# EAGLE design board (EAGLE 6.1)
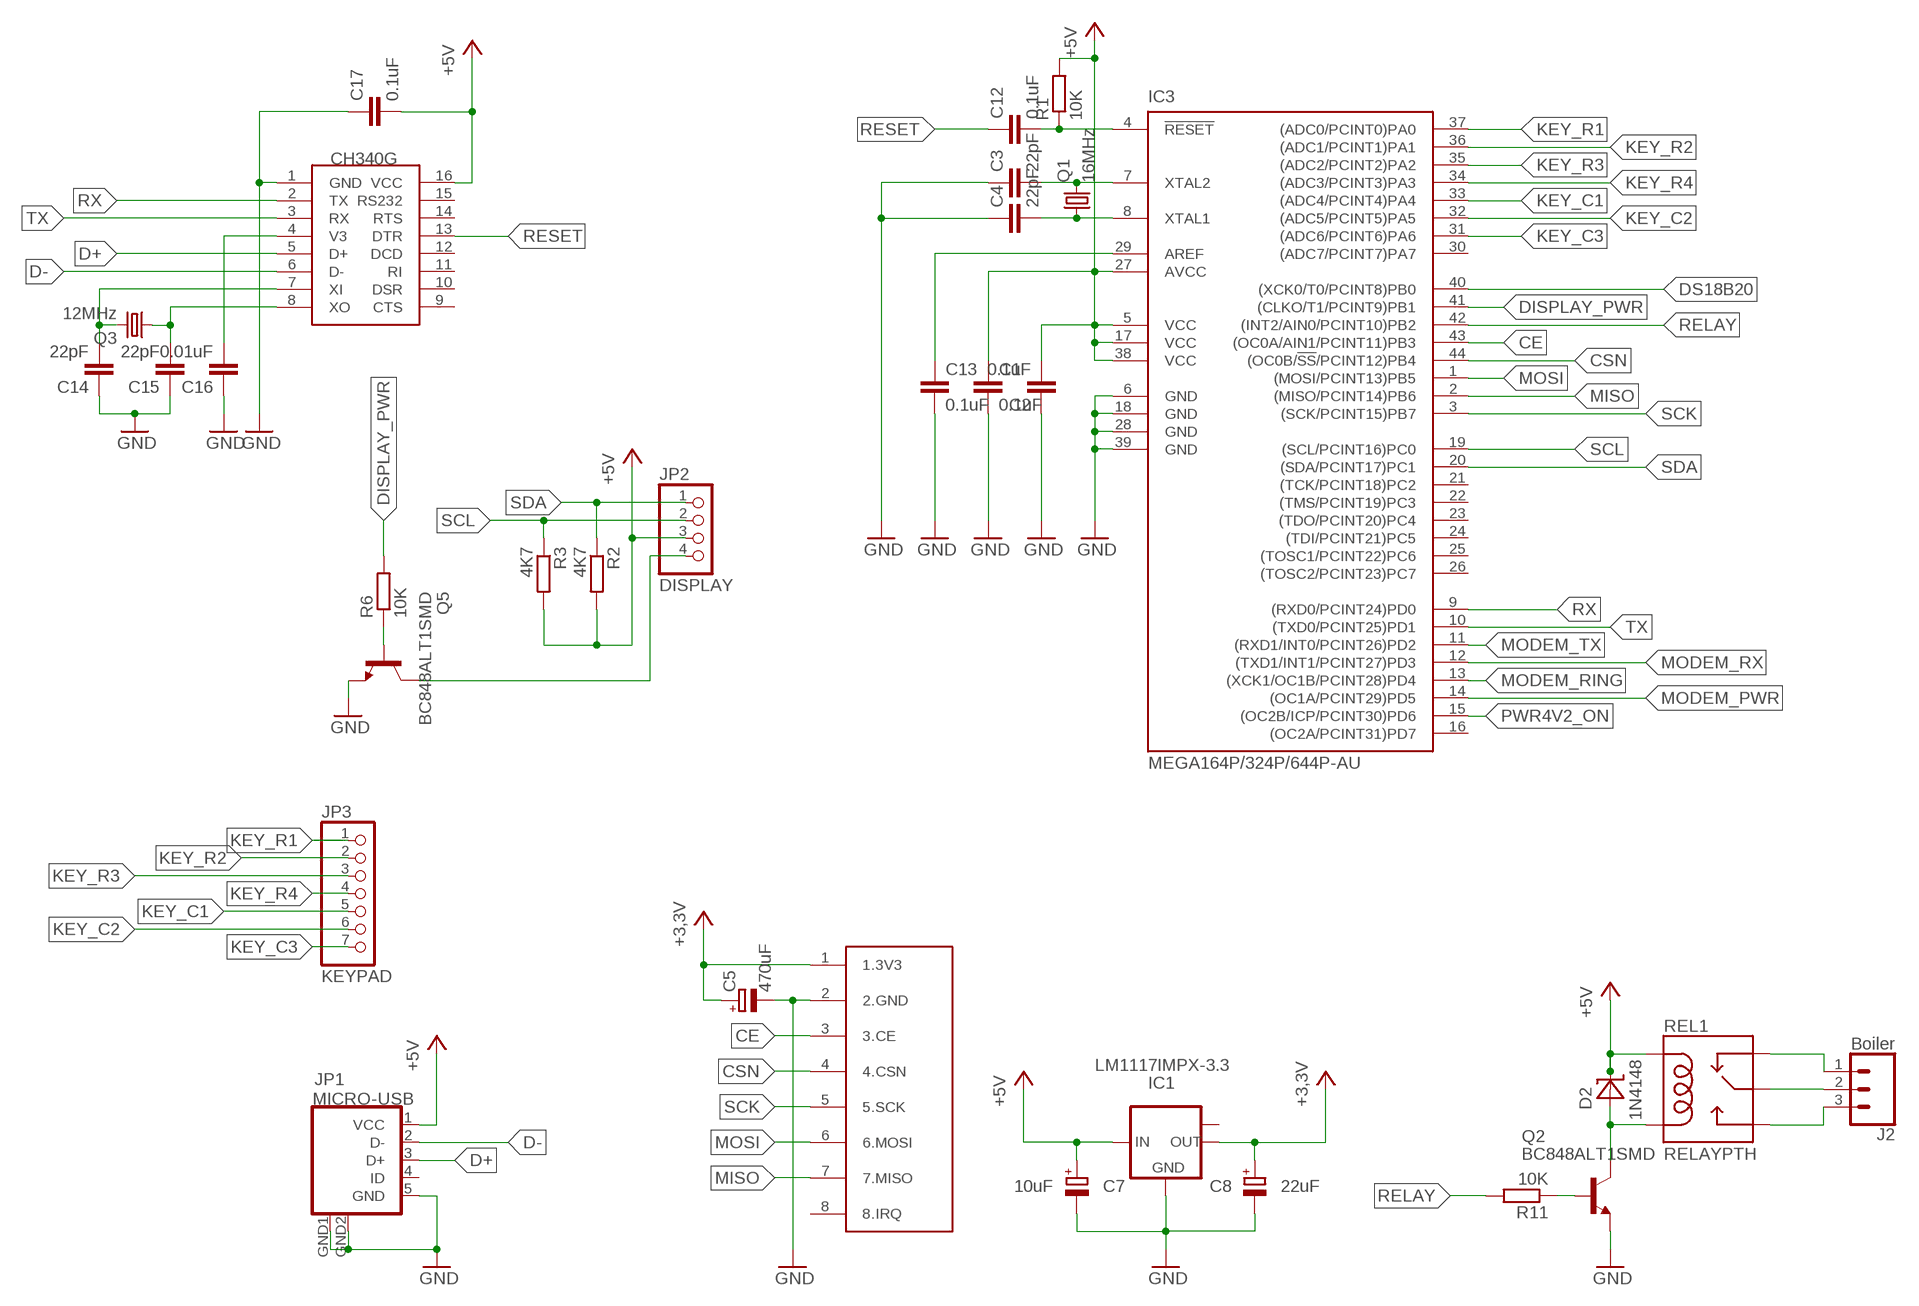
[diagram p0: schematic, sheet 1, part 1 of 2]
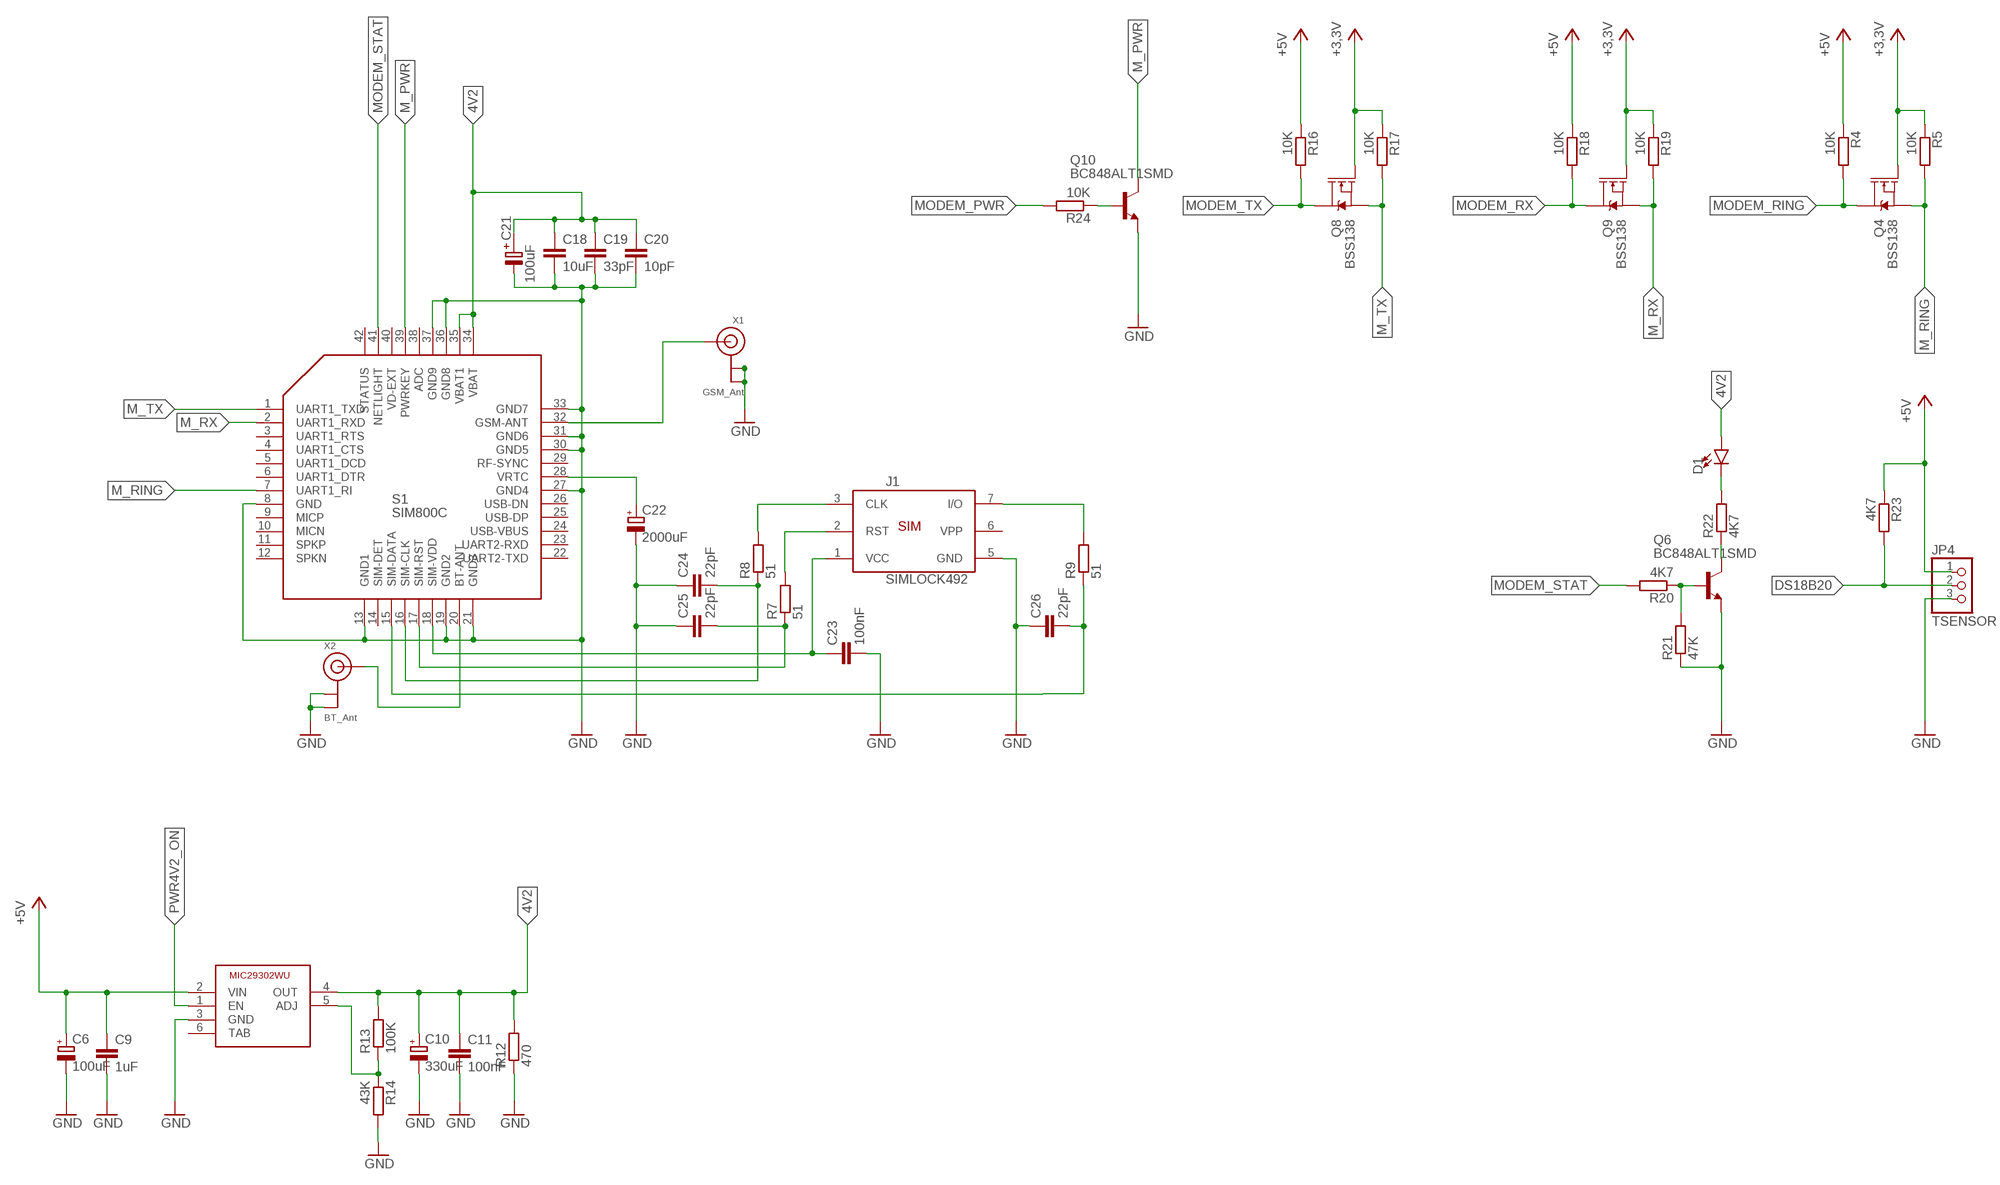
[diagram p1: schematic, sheet 1, part 2 of 2]

## Parts
C1  0.1uF  C-EUC1206  [C1206]
C2  0.1uF  C-EUC1206  [C1206]
C3  22pF  C-EUC1206  [C1206]
C4  22pF  C-EUC1206  [C1206]
C5  470uF  CPOL-EUE3.5-8  [E3,5-8]
C6  100uF  CPOL-EUE1.8-4  [E1,8-4]
C7  10uF  CPOL-EUE1.8-4  [E1,8-4]
C8  22uF  CPOL-EUE1.8-4  [E1,8-4]
C9  1uF  C-EUC1206  [C1206]
C10  330uF  CPOL-EUE1.8-4  [E1,8-4]
C11  100nF  C-EUC1206  [C1206]
C12  0.1uF  C-EUC1206  [C1206]
C13  0.1uF  C-EUC1206  [C1206]
C14  22pF  C-EUC1206  [C1206]
C15  22pF  C-EUC1206  [C1206]
C16  0.01uF  C-EUC1206  [C1206]
C17  0.1uF  C-EUC1206  [C1206]
C18  10uF  C-EUC1206  [C1206]
C19  33pF  C-EUC1206  [C1206]
C20  10pF  C-EUC1206  [C1206]
C21  100uF  C-PR-SMD-TE-D  [TE-D-7343]
C22  2000uF  CPOL-EUE3.5-8  [E3,5-8]
C23  100nF  C-EUC1206  [C1206]
C24  22pF  C-EUC1206  [C1206]
C25  22pF  C-EUC1206  [C1206]
C26  22pF  C-EUC1206  [C1206]
D1  LED1206  [LED-1206]
D2  1N4148  1206ZENERSOD323  [SOD323-W]
IC1  LM1117IMPX-3.3  [SOT223]
IC2  MIC29302WU  [TO263-5]
IC3  MEGA164P/324P/644P-AU  [TQFP44]
J1  SIMLOCK492  [5002]
J2  Boiler  CONN_03-SCREW-5MM  [SCREWTERMINAL-5MM-3]
JP1  MICRO-USB  [MICRO-USB]
JP2  DISPLAY  PINHD-1X4  [1X04]
JP3  KEYPAD  PINHD-1X7  [1X07]
JP4  TSENSOR  PINHD-1X3  [1X03]
Q1  16MHz  CRYTALHC49S  [HC49/S]
Q2  BC848ALT1SMD  [SOT23]
Q3  12MHz  CRYTALHC49S  [HC49/S]
Q4  BSS138  MOSFET-NCH-BSS138  [SOT23-3]
Q5  BC848ALT1SMD  [SOT23]
Q6  BC848ALT1SMD  [SOT23]
Q8  BSS138  MOSFET-NCH-BSS138  [SOT23-3]
Q9  BSS138  MOSFET-NCH-BSS138  [SOT23-3]
Q10  BC848ALT1SMD  [SOT23]
R1  10K  R-EU_R1206  [R1206]
R2  4K7  R-EU_R1206  [R1206]
R3  4K7  R-EU_R1206  [R1206]
R4  10K  R-EU_R1206  [R1206]
R5  10K  R-EU_R1206  [R1206]
R6  10K  R-EU_R1206  [R1206]
R7  51  R-EU_R1206  [R1206]
R8  51  R-EU_R1206  [R1206]
R9  51  R-EU_R1206  [R1206]
R11  10K  R-EU_R1206  [R1206]
R12  470  R-EU_R1206  [R1206]
R13  100K  R-EU_R1206  [R1206]
R14  43K  R-EU_R1206  [R1206]
R16  10K  R-EU_R1206  [R1206]
R17  10K  R-EU_R1206  [R1206]
R18  10K  R-EU_R1206  [R1206]
R19  10K  R-EU_R1206  [R1206]
R20  4K7  R-EU_R1206  [R1206]
R21  47K  R-EU_R1206  [R1206]
R22  4K7  R-EU_R1206  [R1206]
R23  4K7  R-EU_R1206  [R1206]
R24  10K  R-EU_R1206  [R1206]
REL1  RELAYPTH  [SRD-05VDC-SL-C]
S1  SIM800C  [SIM800C]
U$1  CH340G  [SOIC16]
U$3  NRF24L01+  [NRF24L01+]
X1  GSM_Ant  ANTENNA_U.FL  [U.FL]
X2  BT_Ant  ANTENNA_U.FL  [U.FL]

## Nets
4V2: C10.+ C11.1 C18.1 C19.1 C20.1 C21.+ D1.A IC2.4(OUT) R12.2 R13.2 S1.34(VBAT) S1.35(VBAT1)
+3,3V: C5.+ C8.+ IC1.2(OUT) Q4.1(G) Q8.1(G) Q9.1(G) R5.1 R17.1 R19.1 U$3.1(1.3V3)
+5V: C1.1 C2.2 C6.+ C7.+ C9.1 C17.2 D2.C IC1.3(IN) IC2.2(VIN) IC3.5(VCC) IC3.17(VCC) IC3.27(AVCC) IC3.38(VCC) JP1.1(VCC) JP2.3 JP4.1 R1.2 R2.2 R3.2 R4.1 R16.1 R18.1 R23.1 REL1.COIL1 U$1.16(VCC)
CE: IC3.43((OC0A/AIN1/PCINT11)PB3) U$3.3(3.CE)
CSN: IC3.44((OC0B/!SS!/PCINT12)PB4) U$3.4(4.CSN)
D+: JP1.3(D+) U$1.5(D+)
D-: JP1.2(D-) U$1.6(D-)
DISPLAY_PWR: IC3.41((CLKO/T1/PCINT9)PB1) R6.2
DS18B20: IC3.40((XCK0/T0/PCINT8)PB0) JP4.2 R23.2
GND: C1.2 C2.1 C3.1 C4.1 C5.- C6.- C7.- C8.- C9.2 C10.- C11.2 C13.2 C14.1 C15.1 C16.1 C17.1 C18.2 C19.2 C20.2 C21.- C22.- C23.2 C24.1 C25.1 C26.1 IC1.1(GND) IC2.3(GND) IC3.6(GND) IC3.18(GND) IC3.28(GND) IC3.39(GND) J1.5(GND) JP1.5(GND) JP1.GND1(GND) JP1.GND2(GND) JP4.3 Q2.2(E) Q5.2(E) Q6.2(E) Q10.2(E) R12.1 R14.2 R21.1 S1.8(GND) S1.13(GND1) S1.19(GND2) S1.21(GND3) S1.27(GND4) S1.30(GND5) S1.31(GND6) S1.33(GND7) S1.36(GND8) S1.37(GND9) U$1.1(GND) U$3.2(2.GND) X1.1(GND) X1.2(GND) X2.1(GND) X2.2(GND)
KEY_C1: IC3.33((ADC4/PCINT4)PA4) JP3.5
KEY_C2: IC3.32((ADC5/PCINT5)PA5) JP3.6
KEY_C3: IC3.31((ADC6/PCINT6)PA6) JP3.7
KEY_R1: IC3.37((ADC0/PCINT0)PA0) JP3.1
KEY_R2: IC3.36((ADC1/PCINT1)PA1) JP3.2
KEY_R3: IC3.35((ADC2/PCINT2)PA2) JP3.3
KEY_R4: IC3.34((ADC3/PCINT3)PA3) JP3.4
M_PWR: Q10.3(C) S1.39(PWRKEY)
M_RING: Q4.2(S) R5.2 S1.7(UART1_RI)
M_RX: Q9.2(S) R19.2 S1.2(UART1_RXD)
M_TX: Q8.2(S) R17.2 S1.1(UART1_TXD)
MISO: IC3.2((MISO/PCINT14)PB6) U$3.7(7.MISO)
MODEM_PWR: IC3.14((OC1A/PCINT29)PD5) R24.2
MODEM_RING: IC3.13((XCK1/OC1B/PCINT28)PD4) Q4.3(D) R4.2
MODEM_RX: IC3.12((TXD1/INT1/PCINT27)PD3) Q9.3(D) R18.2
MODEM_STAT: R20.2 S1.41(NETLIGHT)
MODEM_TX: IC3.11((RXD1/INT0/PCINT26)PD2) Q8.3(D) R16.2
MOSI: IC3.1((MOSI/PCINT13)PB5) U$3.6(6.MOSI)
N$1: C3.2 IC3.7(XTAL2) Q1.2
N$2: C4.2 IC3.8(XTAL1) Q1.1
N$3: C13.1 IC3.29(AREF)
N$4: C12.2 IC3.4(!RESET) R1.1
N$5: C14.2 Q3.2 U$1.7(XI)
N$6: C15.2 Q3.1 U$1.8(XO)
N$7: JP2.4 Q5.3(C)
N$8: Q5.1(B) R6.1
N$9: C16.2 U$1.4(V3)
N$10: C22.+ S1.28(VRTC)
N$11: C23.1 J1.1(VCC) S1.18(SIM-VDD)
N$12: D2.A Q2.3(C) REL1.COIL0
N$13: Q2.1(B) R11.1
N$14: J2.1 REL1.SWCLOSED(SWCLOSE)
N$15: J2.2 REL1.SWCOMMON
N$16: J2.3 REL1.SWOPEN
N$17: C25.2 R7.1 S1.17(SIM-RST)
N$18: J1.2(RST) R7.2
N$19: IC2.5(ADJ) R13.1 R14.1
N$20: C24.2 R8.1 S1.16(SIM-CLK)
N$21: J1.3(CLK) R8.2
N$22: C26.2 R9.1 S1.15(SIM-DATA)
N$23: J1.7(I/O) R9.2
N$24: S1.32(GSM-ANT) X1.3(SIGNAL)
N$25: Q6.1(B) R20.1 R21.2
N$26: Q6.3(C) R22.1
N$27: D1.C R22.2
N$28: S1.20(BT-ANT) X2.3(SIGNAL)
N$29: Q10.1(B) R24.1
PWR4V2_ON: IC2.1(EN) IC3.15((OC2B/ICP/PCINT30)PD6)
RELAY: IC3.42((INT2/AIN0/PCINT10)PB2) R11.2
RESET: C12.1 U$1.13(DTR)
RX: IC3.9((RXD0/PCINT24)PD0) U$1.2(TX)
SCK: IC3.3((SCK/PCINT15)PB7) U$3.5(5.SCK)
SCL: IC3.19((SCL/PCINT16)PC0) JP2.2 R3.1
SDA: IC3.20((SDA/PCINT17)PC1) JP2.1 R2.1
TX: IC3.10((TXD0/PCINT25)PD1) U$1.3(RX)
Unconnected: IC1.TAB(OUT1) IC2.6(TAB) IC3.16((OC2A/PCINT31)PD7) IC3.21((TCK/PCINT18)PC2) IC3.22((TMS/PCINT19)PC3) IC3.23((TDO/PCINT20)PC4) IC3.24((TDI/PCINT21)PC5) IC3.25((TOSC1/PCINT22)PC6) IC3.26((TOSC2/PCINT23)PC7) IC3.30((ADC7/PCINT7)PA7) J1.6(VPP) JP1.4(ID) S1.3(UART1_RTS) S1.4(UART1_CTS) S1.5(UART1_DCD) S1.6(UART1_DTR) S1.9(MICP) S1.10(MICN) S1.11(SPKP) S1.12(SPKN) S1.14(SIM-DET) S1.22(UART2-TXD) S1.23(UART2-RXD) S1.24(USB-VBUS) S1.25(USB-DP) S1.26(USB-DN) S1.29(RF-SYNC) S1.38(ADC) S1.40(VD-EXT) S1.42(STATUS) U$1.9(CTS) U$1.10(DSR) U$1.11(RI) U$1.12(DCD) U$1.14(RTS) U$1.15(RS232) U$3.8(8.IRQ)

## Library data of the parts
C1-C4 C9 C11-C20 C23-C26 = resistor:C-EU: CAPACITOR, European symbol
C5-C8 C10 C22 = resistor:CPOL-EU: POLARIZED CAPACITOR, European symbol
C21 = cap-pan40:C-PR: POLARIZED ELECTROLYTIC/TANTALUM
D1 = SparkFun-LED:LED: LED (Generic) Standard schematic elements and footprints for 5mm, 3mm, 1206, and 0603 sized LEDs. Generic LEDs with no color specified.
D2 = matt diode:1206ZENER
IC1 = lm1117:LM1117IMPX-*
IC2 = MIC29302WU:MIC29302WU; AVAILABILITY: Good; DESCRIPTION: IC REG LINEAR POS ADJ 3A TO263-5; MF: Microchip; MP: MIC29302WU; PACKAGE: TO-263-5 Microchip; PRICE: 1.41 USD
IC3 = avr-5:MEGA164P/324P/644P-AU
J1 = amphenol-simlock:SIMLOCK492
J2 = SparkFun-Connectors:CONN_03: Multi connection point. Often used as Generic Header-pin footprint for 0.1 inch spaced/style header connections On any of the 0.1 inch spaced packages, you can populate with these: Break Away Headers - Straight <https://www.sparkfun.com/products/116> (PRT-00116) Break Away Male Headers - Right Angle <https://www.sparkfun.com/products/553> (PRT-00553) Female Headers <https://www.sparkfun.com/products/115> (PRT-00115) Break Away Headers - Machine Pin <https://www.sparkfun.com/products/117> (PRT-00117) Break Away Female Headers - Swiss Machine Pin <https://www.sparkfun.com/products/743> (PRT-00743) Stackable Header - 3 Pin (Female, 0.1") <https://www.sparkfun.com/products/13875> (PRT-13875) For SCREWTERMINALS and SPRING TERMINALS visit here: Screw Terimnals on SparkFun.com <https://www.sparkfun.com/search/results?term=Screw+Terminals> (5mm/3.5mm/2.54mm spacing) This device is also useful as a general connection point to wire up your design to another part of your project. Our various solder wires solder well into these plated through hole pads. Hook-Up Wire - Assortment (Stranded, 22 AWG) <https://www.sparkfun.com/products/11375> (PRT-11375) Hook-Up Wire - Assortment (Solid Core, 22 AWG) <https://www.sparkfun.com/products/11367> (PRT-11367) View the entire wire category on our website here <https://www.sparkfun.com/categories/141> Special notes: Molex polarized connector foot print use with SKU : PRT-08232 with associated crimp pins and housings.; PROD_ID: CONN-10134; SF_SKU: PRT-08433
JP1 = microusb:MICRO-USB: Micro USB B connector
JP2 = pinhead:PINHD-1X4: PIN HEADER
JP3 = pinhead:PINHD-1X7: PIN HEADER
JP4 = pinhead:PINHD-1X3: PIN HEADER
Q1 Q3 = crystal:CRYTAL: CRYSTAL
Q2 Q5 Q6 Q10 = transistor-npn:BC848*: NPN Transistor
Q4 Q8 Q9 = SparkFun-DiscreteSemi:MOSFET-NCH: N-channel MOSFETs Voltage controlled devices that allow control of high current outputs. SparkFun Products: SparkFun OpenScale <https://www.sparkfun.com/products/13261> SparkFun Digital Sandbox <https://www.sparkfun.com/products/12651> SparkFun Monster Moto Shield <https://www.sparkfun.com/products/10182> SparkFun MOSFET Power Controller <https://www.sparkfun.com/products/11214>; PROD_ID: TRANS-00830; VALUE: 220mA/50V/3.5Ω
R1-R9 R11-R14 R16-R24 = resistor:R-EU_: RESISTOR, European symbol
REL1 = SRD-05VDC-SL-C:RELAY: SPDT relay (COM-00101)
S1 = Sim800c:SIM800C: SIM800c quad band GSM moude
U$1 = ch340g:CH340G
U$3 = NRF24l01+:NRF24L01+
X1 X2 = adafruit1:ANTENNA_U.FL: U.FL Antenna Connector

## Board
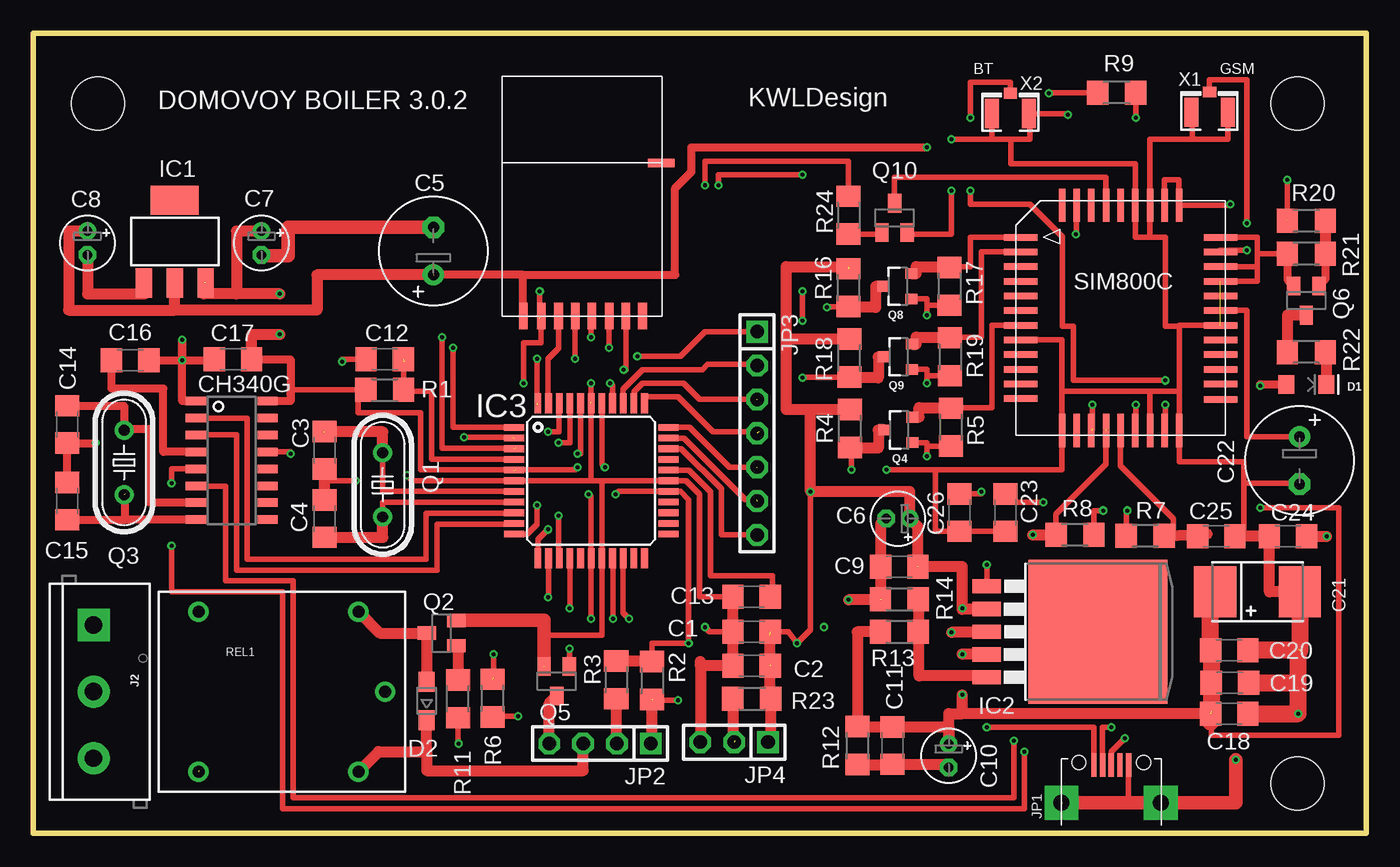
[diagram p2: board, top side]
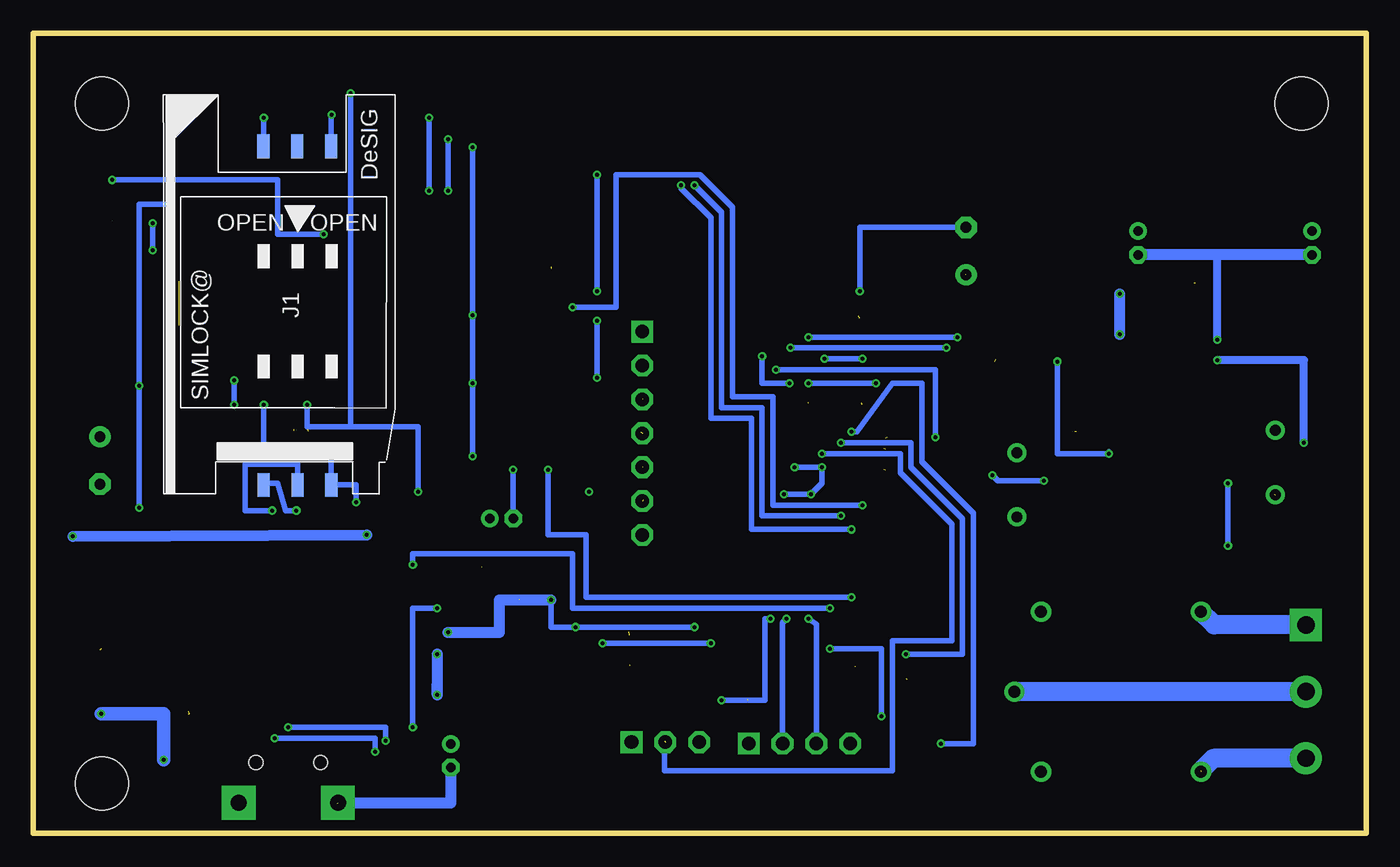
[diagram p3: board, bottom side, seen from below]

Size 100 x 60 mm. Coordinates in mm from the lower left corner, seen from the top.
Outline: 0,0 100,0
Outline: 100,0 100,60
Outline: 100,60 0,60
Outline: 0,60 0,0
Outline: 0,60 100,60
Outline: 100,60 100,0
Outline: 100,0 0,0
Outline: 0,0 0,60
Copper layers (1*16): Top 0.035mm / dielectric 1.5mm / Bottom 0.035mm
Design rules: minimum track width 8mil, minimum drill 0.3mm, track to track 8mil, track to pad 8mil, pad to pad 8mil, via to via 8mil, smd to smd 8mil, copper to edge 40mil, drill to drill 8mil, minimum pad ring 12mil, minimum via ring 6mil, stop-mask expansion 4mil, vias tented up to drill 0mil, thermal gap 10mil
Holes 4 mm at 4.84,54.74 94.84,54.74 94.84,3.74

### Footprints (pad centres in the part's own frame; a part is rotated, then mirrored left to right if it is on the bottom)
C1206 = smd 1.6 x 1.8: 1 -1.4,0; 2 1.4,0
E3,5-8 = drill 0.813 pad 1.6: + -1.778,0 | drill 0.813 pad 1.6 octagon: - 1.778,0
E1,8-4 = drill 0.711 pad 1.168: + -0.889,0 | drill 0.711 pad 1.168 octagon: - 0.889,0
TE-D-7343 = smd 3.175 x 3.81: + 3.175,0; - -3.175,0
LED-1206 = smd 1.2 x 1.4: A -1.5,0; C 1.5,0
SOD323-W = smd 1.5 x 1.2: A 1.45,0; C -1.45,0
SOT223 = smd 1.219 x 2.235: 1 -2.311,-3.099; 2 0,-3.099; 3 2.311,-3.099 | smd 3.6 x 2.2: TAB 0,3.099
TO263-5 = smd 1.067 x 2.159: 1 -3.404,-5.791; 2 -1.702,-5.791; 3 0,-5.791; 4 1.702,-5.791; 5 3.404,-5.791 | smd 10.8 x 10.41: 6 0,2.54
TQFP44 = smd 1.5 x 0.5: 1 -5.8,4; 2 -5.8,3.2; 3 -5.8,2.4; 4 -5.8,1.6; 5 -5.8,0.8; 6 -5.8,0; 7 -5.8,-0.8; 8 -5.8,-1.6; 9 -5.8,-2.4; 10 -5.8,-3.2; 11 -5.8,-4; 23 5.8,-4; 24 5.8,-3.2; 25 5.8,-2.4; 26 5.8,-1.6; 27 5.8,-0.8; 28 5.8,0; 29 5.8,0.8; 30 5.8,1.6; 31 5.8,2.4; 32 5.8,3.2; 33 5.8,4 | smd 0.5 x 1.5: 12 -4,-5.8; 13 -3.2,-5.8; 14 -2.4,-5.8; 15 -1.6,-5.8; 16 -0.8,-5.8; 17 0,-5.8; 18 0.8,-5.8; 19 1.6,-5.8; 20 2.4,-5.8; 21 3.2,-5.8; 22 4,-5.8; 34 4,5.8; 35 3.2,5.8; 36 2.4,5.8; 37 1.6,5.8; 38 0.8,5.8; 39 0,5.8; 40 -0.8,5.8; 41 -1.6,5.8; 42 -2.4,5.8; 43 -3.2,5.8; 44 -4,5.8
5002 = smd 1.778 x 0.914: 1 0.65,0.32; 2 0.65,2.86; 3 0.65,5.4; 5 26.045,0.34; 6 26.045,2.88; 7 26.045,5.42
SCREWTERMINAL-5MM-3 = drill 1.3 pad 2.413 square: 1 0,0 | drill 1.3 pad 2.413: 2 5,0; 3 10,0
MICRO-USB = smd 0.4 x 1.75: 1 -1.3,4.525; 2 -0.65,4.525; 3 0,4.525; 4 0.65,4.525; 5 1.3,4.525 | drill 1.2 pad 2.54 square: GND1 -3.725,1.7; GND2 3.725,1.7 | hole 1.05: -2.425,4.73; 2.425,4.73
1X04 = drill 1.016 square: 1 -3.81,0 | drill 1.016 octagon: 2 -1.27,0; 3 1.27,0; 4 3.81,0
1X07 = drill 1.016 square: 1 -7.62,0 | drill 1.016 octagon: 2 -5.08,0; 3 -2.54,0; 4 0,0; 5 2.54,0; 6 5.08,0; 7 7.62,0
1X03 = drill 1.016 square: 1 -2.54,0 | drill 1.016 octagon: 2 0,0; 3 2.54,0
HC49/S = drill 0.813: 1 -2.413,0; 2 2.413,0
SOT23 = smd 1 x 1.4: 1 -0.95,-1.1; 2 0.95,-1.1; 3 0,1.1
SOT23-3 = smd 0.8 x 0.9: 1 -0.95,-1; 2 0.95,-1; 3 0,1.1
R1206 = smd 1.6 x 1.803: 1 -1.422,0; 2 1.422,0
SRD-05VDC-SL-C = drill 0.9: COIL0 -5.39,-6.12; COIL1 -5.39,5.88; SWCLOSED 6.61,-6.12; SWCOMMON -7.39,-0.12; SWOPEN 6.61,5.88
SIM800C = smd 2.5 x 0.48: 1 -6.85,2.05; 2 -6.85,0.95; 3 -6.85,-0.15; 4 -6.85,-1.25; 5 -6.85,-2.35; 6 -6.85,-3.45; 7 -6.85,-4.55; 8 -6.85,-5.65; 9 -6.85,-6.75; 10 -6.85,-7.85; 11 -6.85,-8.95; 12 -6.85,-10.05; 22 8.15,-10.1; 23 8.15,-8.95; 24 8.15,-7.85; 25 8.15,-6.75; 26 8.15,-5.65; 27 8.15,-4.55; 28 8.15,-3.45; 29 8.15,-2.35; 30 8.15,-1.25; 31 8.15,-0.15; 32 8.15,0.95; 33 8.15,2.05 | smd 0.48 x 2.5: 13 -3.75,-12.45; 14 -2.65,-12.45; 15 -1.55,-12.45; 16 -0.45,-12.45; 17 0.65,-12.45; 18 1.75,-12.45; 19 2.85,-12.45; 20 3.95,-12.45; 21 5.05,-12.45; 34 5.05,4.45; 35 3.95,4.45; 36 2.85,4.45; 37 1.75,4.45; 38 0.65,4.45; 39 -0.45,4.45; 40 -1.55,4.45; 41 -2.65,4.45; 42 -3.75,4.45
SOIC16 = smd 0.635 x 1.524: 1 -4.445,-2.695; 2 -3.175,-2.695; 3 -1.905,-2.695; 4 -0.635,-2.695; 5 0.635,-2.695; 6 1.905,-2.695; 7 3.175,-2.695; 8 4.445,-2.695; 9 4.445,2.695; 10 3.175,2.695; 11 1.905,2.695; 12 0.635,2.695; 13 -0.635,2.695; 14 -1.905,2.695; 15 -3.175,2.695; 16 -4.445,2.695
NRF24L01+ = smd 0.65 x 2: 1 1.6,0; 2 2.95,0; 3 4.25,0; 4 5.5,0; 5 6.75,0; 6 8.05,0; 7 9.3,0; 8 10.55,0 | smd 2 x 0.65: 9 11.96,11.49
U.FL = smd 2.2 x 1.05: 1 0,1.375; 2 0,-1.375 | smd 0.8 x 1: 3 1.525,0

### Placement (x,y rotation side)
C1  53.9,15.12 180 top
C2  53.9,12.58 0 top
C3  21.84,28.73 90 top
C4  21.84,23.6 270 top
C5  30.02,43.67 90 top
C6  64.87,23.6 180 top
C7  17.12,44.28 270 top
C8  4.06,44.28 270 top
C9  64.97,19.99 180 top
C10  68.68,5.82 270 top
C11  64.47,6.58 270 top
C12  26.37,35.54 0 top
C13  53.9,17.76 180 top
C14  2.54,30.66 90 top
C15  2.54,24.92 270 top
C16  7.26,35.49 180 top
C17  14.99,35.54 0 top
C18  89.71,8.97 0 top
C19  89.76,11.31 0 top
C20  89.71,13.75 0 top
C21  91.85,18.12 180 top
C22  95,27.97 270 top
C23  72.95,24.06 270 top
C24  94.13,22.28 0 top
C25  88.75,22.28 180 top
C26  69.49,24.06 90 top
D1  95.5,33.66 0 top
D2  29.51,9.94 90 top
IC1  10.62,44.38 0 top
IC2  77.32,15.12 270 top
IC3  41.86,26.45 0 top
J1  77.32,25.48 90 bottom
J2  4.52,15.63 270 top
JP1  80.87,0.59 0 top
JP2  42.52,6.74 180 top
JP3  54.31,30 270 top
JP4  52.58,6.84 180 top
Q1  26.21,26.14 90 top
Q2  30.63,15.02 90 top
Q3  6.81,27.82 90 top
Q4  64.97,30.26 90 top
Q5  39.27,11.41 180 top
Q6  95.5,39.96 180 top
Q8  64.87,41.03 90 top
Q9  64.92,35.74 90 top
Q10  64.62,46.16 0 top
R1  26.37,33.25 180 top
R2  46.43,11.46 90 top
R3  43.74,11.51 90 top
R4  61.26,30.36 270 top
R5  68.83,30.46 90 top
R6  34.44,10.14 90 top
R7  83.41,22.33 180 top
R8  78.15,22.38 0 top
R9  81.28,55.55 0 top
R11  31.85,10.09 270 top
R12  61.82,6.58 90 top
R13  64.97,15.12 180 top
R14  64.97,17.56 180 top
R16  61.16,40.92 270 top
R17  68.73,41.03 90 top
R18  61.21,35.64 270 top
R19  68.78,35.74 90 top
R20  95.5,45.95 180 top
R21  95.5,43.46 0 top
R22  95.5,36.1 0 top
R23  53.9,10.09 180 top
R24  61.16,46.36 90 top
REL1  19,10.5 180 top
S1  80.92,42.65 0 top
U$1  14.88,27.97 270 top
U$3  35.15,38.79 0 top
X1  88.24,54.08 90 top
X2  73.3,53.98 90 top

### Tracks (layer width: path | path; a pad name or v marks a point on that pad's centre or on a via)
4V2  (via drill 0.3)  (2 unrouted)
  Top 0.406: S1.35 84.87,49 85.95,49 85.95,47.1 S1.34 89.81,47.1 v89.81,47.17 | v92.05,24.41 97.94,24.41 97.94,14.66 97.94,7.35 93.27,7.35 88.39,7.35 88.39,8.97
  Top 0.61: D1.A 92.05,33.66 v92.05,33.56
  Top 0.813: IC2.4 71.53,13.44 v69.7,13.44 | 88.39,8.97 69.7,8.97 | 69.7,8.97 v69.7,10.39 | R13.2 61.82,15.12 R12.2 64.47,8.01 C11.1 68.68,7.98 C10.+ 68.68,8.97 69.7,8.97
  Top 1.27: C19.1 88.36,13.75 C20.1 88.31,18.12 C21.+ | C19.1 88.31,11.31 | C18.1 88.31,8.36 | C19.1 88.36,9.17 88.19,9.17
  Bottom 0.406: v89.81,47.17 92.05,47.17 92.05,33.76 | 92.05,33.76 v92.05,33.56 | v92.05,33.56 v92.05,24.41 | v92.05,33.56 92.05,33.76
  Bottom 0.813: v69.7,13.44 69.7,11.21 | 69.7,11.21 v69.7,10.39 69.7,11.21
+3,3V  (via drill 0.3)  (1 unrouted)
  Top 0.406: R17.1 67.06,39.6 v67.06,38.84 67.06,40.08 Q8.1 | R19.1 67.06,34.32 v67.06,33.76 67.06,34.79 Q9.1 | R5.1 67.06,29.04 67.06,28.89 | 67.06,28.89 v67.06,28.28 | Q4.1 67.06,29.31 67.06,28.89
  Top 0.61: 36.75,41.89 U$3.1 36.75,41.89 | 36.75,41.89 30.07,41.89 | 36.75,41.89 48.16,41.89 48.16,48.39 49.38,49.61 49.38,51.44 v67.06,51.44
  Top 0.813: C8.+ 2.64,45.17 2.64,39.25 10.36,39.25 | 10.36,39.25 10.57,39.25 10.62,39.25 IC1.2 | 10.36,39.25 21.29,39.25 21.29,41.89 C5.+
  Bottom 0.406: 67.06,44.12 67.06,43.92 | 67.06,43.92 v67.06,38.84 v67.06,33.76 v67.06,28.28 | v67.06,51.44 67.06,43.92
+5V  (via drill 0.3)  (6 unrouted)
  Top 0.406: R1.2 24.38,33.25 | 24.38,33.25 24.38,33.36 24.38,33.25 | 24.38,33.25 24.38,31.53 29.06,31.53 29.06,27.26 36.17,27.26 40.64,27.26 v40.84,27.46 | v42.88,27.46 42.66,27.68 IC3.38 | v41.66,25.43 41.86,25.23 IC3.17 v41.86,16.08 | v43.69,25.43 43.9,25.65 IC3.27 48.56,25.65 49.17,25.04 v49.17,14.25 46.43,14.25 R2.2 | 24.38,33.25 19.3,33.25 19.3,32.95 | JP1.1 79.57,7.95 v71.53,7.95 | C1.1 56.64,15.12 v57.3,14.25 58.32,15.27 v58.32,25.63
  Top 0.61: C17.2 19.3,35.54 19.3,32.95 19.3,32.54 19.3,32.42 U$1.16
  Top 0.813: IC2.2 71.53,16.79 69.7,16.79 v69.7,16.9 69.7,19.99 66.34,19.99 66.34,23.02 C6.+ 65.76,25.63 v58.32,25.63 58.32,31.78 | C7.+ 15.24,45.17 15.24,40.67 15.24,40.47 | 15.24,40.47 12.8,40.47 12.8,41.28 | REL1.COIL1 25.9,6.13 29.46,6.13 29.52,6.18 | 29.52,6.18 D2.C | C17.2 16.39,37.42 v18.49,37.42 | v18.49,40.47 15.24,40.47 | 29.52,6.18 29.52,4.7 41.25,4.7 JP2.3 | 61.16,42.5 56.49,42.5 56.49,37.06 | R18.1 56.49,37.06 | R4.1 58.32,31.78 | 58.32,31.78 56.49,31.78 56.49,37.06 | JP4.1 55.32,6.63 R23.1 55.27,10.09 55.27,12.63 | C2.2 55.27,12.58 55.27,14.86 | R3.2 46.43,12.93 R2.2
  Bottom 0.406: v42.88,27.46 v40.84,27.46 40.84,26.24 v41.66,25.43 v43.69,25.43 | v41.86,16.08 41.25,15.68 JP2.3 | v58.32,25.63 58.32,25.65 | v71.53,7.95 71.53,16.9 v69.7,16.9 | v49.17,14.25 v57.3,14.25
  Bottom 0.813: v18.49,37.42 v18.49,40.47
CE
  Top 0.406: U$3.3 39.4,36.39 38.61,35.59 38.61,32.3 IC3.43
CSN  (via drill 0.3)  (1 unrouted)
  Top 0.406: U$3.4 40.65,36.62 v40.64,35.59 | v37.8,35.59 37.8,32.14
  Bottom 0.406: v40.64,35.59 v37.8,35.59
D+  (via drill 0.3)
  Top 0.406: JP1.3 80.87,6.12 v81.89,7.14 | U$1.5 10.36,27.33 v10.36,26.24 | v10.36,21.57 10.36,18.12 18.69,18.12 18.69,1.86 23.37,1.86 74.37,1.86 v74.37,6.13
  Bottom 0.406: v81.89,7.14 75.59,7.14 74.37,7.14 v74.37,6.13 | v10.36,26.24 v10.36,21.57
D-  (via drill 0.3)
  Top 0.406: JP1.2 80.22,7.95 v80.87,7.95 | v73.56,6.94 73.56,2.67 19.51,2.67 19.51,18.93 14.43,18.93 14.43,26.04 12.19,26.04 U$1.6
  Bottom 0.406: v80.87,7.95 73.56,7.95 v73.56,6.94
DISPLAY_PWR  (via drill 0.3)  (1 unrouted)
  Top 0.406: IC3.41 40.26,29.29 v39.42,29.29 | v34.54,13.44 34.54,11.61
  Bottom 0.406: v39.42,29.29 39.22,29.29 34.14,29.29 34.14,27.46 30.28,23.6 30.28,13.44 v34.54,13.44
DS18B20  (via drill 0.3)  (1 unrouted)
  Top 0.406: IC3.40 41.06,28.48 v40.84,28.48
  Top 0.813: R23.2 52.48,6.84 JP4.2
  Bottom 0.406: v40.84,28.48 34.95,28.48 34.95,27.06 31.09,23.2 31.09,14.46 35.56,14.46 35.56,4.7 52.63,4.7 52.63,6.94
GND  (via drill 0.3)  (7 unrouted)
  Top 0.406: v24.18,26.45 21.84,26.45 21.84,26.65 | v28.04,26.85 28.45,26.45 IC3.6 41.66,26.45 | 41.66,26.45 41.86,26.45 41.86,32.34 v41.86,33.76 | 42.06,26.45 42.66,26.45 IC3.18 42.67,20.65 42.67,14.86 38.3,14.86 | 42.06,26.45 41.66,26.45 | 42.06,26.45 IC3.28 48.97,26.45 49.99,25.43 49.99,24.62 49.99,17.76 C13.2 | U$3.2 38.1,36.81 36.78,36.81 v36.78,33.76 | v38,40.67 38,38.64 | 67.67,27.26 77.17,27.26 S1.13 77.17,33.15 | 67.67,27.26 v64.01,27.26 | 83.77,44.7 S1.36 83.77,52.05 86.97,52.05 | 83.77,44.7 82.67,44.7 S1.37 82.67,50.22 73.36,50.22 73.36,52.05 | S1.8 77.17,37 77.17,33.15 | S1.19 83.77,33.15 | 83.77,33.15 77.17,33.15 | 85.97,33.15 S1.21 85.97,27.87 90.83,27.87 90.83,26.24 | 85.97,33.15 83.77,33.15 | S1.27 85.97,38.1 | 85.97,38.1 85.97,33.15 | 83.77,44.7 84.94,44.7 84.94,38.03 85.97,38.03 85.97,38.1 | C23.2 C26.1 67.67,22.66 67.67,27.26 | 90.83,26.24 90.83,22.38 C25.1 | C22.- 95,26.24 90.83,26.24 | S1.33 91.85,44.7 | 91.85,44.7 91.85,42.5 | 91.85,42.5 S1.31 | S1.30 91.85,41.4 91.85,42.5 | X1.2 89.61,52.05 86.97,52.05 | 86.97,52.05 86.97,53.88 X1.1 | X2.1 71.93,52.05 72.34,52.05 | 72.34,52.05 73.36,52.05 | 73.36,52.05 74.78,52.05 74.78,53.98 X2.2 77.62,53.98 v77.62,53.88 | 91.85,44.7 91.85,43.46 R21.1 | JP1.5 82.17,2.29 82.09,2.29 | C1.2 50.75,15.12 v50.39,15.47 | Q10.2 65.57,44.94 68.89,44.94 v68.89,48.19 | v68.89,52.05 72.34,52.05
  Top 0.61: C15.1 C14.1 4.67,29.26 v4.67,29.29 | C16.1 v11.18,35.49 | v11.18,35.49 13.59,35.49 C17.1 | U$1.1 11.18,32.42 v11.18,35.49 | v11.18,35.49 v11.18,37.01 | v11.18,37.01 v11.18,35.49 | v11.18,35.49 v11.18,37.01 | R21.1 94.08,41.53 Q6.2
  Top 0.813: C6.- 63.57,23.19 C9.2 63.57,17.3 | C8.- 4.06,40.47 8.33,40.47 8.33,41.28 IC1.1 | C4.1 21.84,26.65 C3.1 | 50.04,12.88 50.04,12.63 | 50.04,12.63 JP4.3 | C25.1 C24.1 92.73,18.12 C21.- | 50.04,12.63 50.04,12.58 C2.1 C1.2 C13.2 | 63.57,17.3 63.6,17.3 | R12.1 64.47,5.16 C11.2 68.68,5.18 C10.- | 63.57,17.3 63.57,17.51 v61.16,17.51 | IC2.3 71.53,15.07 v68.89,15.07
  Top 1.016: C5.- 19.1,45.45 19.1,43.31 17.12,43.31 C7.- | C18.2 v94.89,8.97 | v90.22,5.52 90.22,2.29 JP1.GND2 82.09,2.29 JP1.GND1 | Q2.2 38.3,15.97 38.3,14.86 38.3,12.53
  Top 1.27: C21.- 95.02,13.75 C20.2 | C19.2 94.89,11.31 94.89,11.41 | 94.89,11.41 94.89,13.85 | C18.2 v94.89,8.97 94.89,11.41
  Bottom 0.406: v24.18,26.45 27.64,26.45 v28.04,26.85 | v36.78,33.76 v41.86,33.76 | v38,40.67 38,45.45 C5.- | v64.01,27.26 64.01,23.6 C6.- | v77.62,53.88 77.66,53.88 J1.5 | v50.39,15.47 v59.33,15.47 61.16,15.47 v61.16,17.51 | v68.89,48.19 v68.89,52.05
  Bottom 0.61: v4.67,29.29 4.67,35.49 v11.18,35.49 | v11.18,37.01 11.18,43.39
  Bottom 0.813: C8.- 11.18,43.39 C7.- | C10.- 68.68,2.27 77.22,2.27 | v68.89,15.07 65.02,15.07 65.02,17.51 v61.16,17.51
  Bottom 1.016: v90.22,5.52 90.22,8.97 v94.89,8.97
KEY_C1  (1 unrouted)
  Top 0.406: IC3.33 49.24,30.45 52.22,27.46 54.25,27.46
KEY_C2  (1 unrouted)
  Top 0.406: IC3.32 48.82,29.65 53.44,25.02 54.25,25.02
KEY_C3
  Top 0.406: IC3.31 48.6,28.85 51.61,25.84 51.61,22.38 JP3.7
KEY_R1  (via drill 0.3)
  Top 0.406: IC3.37 43.46,33.58 v43.28,33.76 | v45.31,35.79 48.16,35.79 48.56,35.79 50.39,37.62 JP3.1
  Bottom 0.406: v43.28,33.76 45.11,33.76 45.31,33.76 v45.31,35.79
KEY_R2
  Top 0.406: IC3.36 44.26,33.32 45.72,34.78 48.36,34.78 50.19,34.78 50.6,35.18 54.2,35.18 JP3.2
KEY_R3  (1 unrouted)
  Top 0.406: IC3.35 45.06,33.1 45.72,33.76 48.77,33.76 49.99,32.54 54.25,32.54
KEY_R4  (1 unrouted)
  Top 0.406: 45.86,32.75 IC3.34 45.86,32.75 | 45.86,32.75 47.55,32.75 48.36,32.75 51,30.1 54.46,30.1
M_PWR
  Top 0.406: S1.39 80.47,49.2 68.68,49.2 64.62,49.2 Q10.3
M_RING
  Top 0.406: S1.7 71.93,38.1 71.93,31.93 68.83,31.93 R5.2
  Top 0.813: Q4.2 66.45,31.21 66.45,31.93 68.83,31.93 R5.2
M_RX
  Top 0.406: S1.2 71.12,43.6 71.12,37.22 68.78,37.22 R19.2
  Top 0.813: Q9.2 66.24,36.69 66.24,37.22 68.78,37.22 R19.2
M_TX
  Top 0.406: S1.1 70.31,44.7 70.31,42.5 68.73,42.5 R17.2
  Top 0.813: Q8.2 66.24,41.98 66.24,42.5 68.73,42.5 R17.2
MISO  (via drill 0.3)  (1 unrouted)
  Top 0.406: U$3.7 44.45,34.78 v44.3,34.78 | v32.31,29.7 35.97,29.7
  Bottom 0.406: v44.3,34.78 32.31,34.78 v32.31,29.7
MODEM_PWR  (via drill 0.3)
  Top 0.406: IC3.14 39.42,20.69 v39.42,23.8 | v50.39,48.59 50.39,50.42 61.16,50.42 R24.2
  Bottom 0.406: v39.42,23.8 45.31,23.8 45.31,30.1 45.31,31.93 48.36,31.93 48.36,34.17 48.36,46.56 v50.39,48.59
MODEM_RING  (via drill 0.3)
  Top 0.406: IC3.13 38.66,17.71 v38.61,17.71 | v61.37,27.26 61.37,28.94 R4.2
  Top 0.813: Q4.3 63.4,30.26 63.4,28.89 61.27,28.89 R4.2
  Bottom 0.406: v38.61,17.71 58.52,17.71 58.52,22.38 61.37,22.38 v61.37,27.26
MODEM_RX  (via drill 0.3)
  Top 0.406: IC3.12 37.86,22.04 v38.61,22.79 | v51.41,48.59 51.41,49.41 v57.71,49.41 | v57.71,40.67 v57.71,38.44 | v57.71,34.17 57.71,34.22 R18.2
  Top 0.813: Q9.3 63.4,35.74 63.4,34.17 61.21,34.17 R18.2
  Bottom 0.406: v38.61,22.79 46.13,22.79 46.13,27.46 46.13,31.12 49.17,31.12 49.17,35.79 49.17,46.16 51.41,48.39 v51.41,48.59 | v57.71,49.41 v57.71,40.67 | v57.71,38.44 v57.71,34.17
MODEM_STAT  (via drill 0.3)  (1 unrouted)
  Top 0.406: S1.41 78.27,44.94 v78.23,44.94 | v94.08,49 R20.2
  Bottom 0.406: v78.23,44.94 81.69,44.94 81.69,49 v94.08,49
MODEM_TX  (via drill 0.3)
  Top 0.406: v59.54,39.45 59.59,39.5 R16.2 | IC3.11 37.05,22.45 37.8,23.2 v37.8,24.62
  Top 0.813: Q8.3 63.2,41.03 63.2,39.45 61.16,39.45 R16.2
  Bottom 0.406: v37.8,24.62 44.5,24.62 44.5,30.1 44.5,32.75 47.55,32.75 47.55,46.97 49.99,49.41 56.29,49.41 56.29,49.2 56.29,39.45 v59.54,39.45
MOSI  (via drill 0.3)
  Top 0.406: U$3.6 43.2,36.4 v43.18,36.4 | v31.5,36.4 31.5,30.45 IC3.1
  Bottom 0.406: v43.18,36.4 v31.5,36.4
N$1  (1 unrouted)
  Top 0.406: IC3.7 26.21,25.65 Q1.2
  Top 0.813: Q1.2 26.21,30.1 21.74,30.1
N$2
  Top 0.406: IC3.8 26.21,24.85 Q1.1
  Top 0.813: C4.2 26.21,22.2 Q1.1
N$3
  Top 0.406: IC3.29 49.19,27.25 50.8,25.63 50.8,19.33 55.47,19.33 55.47,17.76 C13.1
N$4  (1 unrouted)
  Top 0.406: 27.84,35.39 27.79,35.34 R1.1 27.79,33.15 29.87,33.15 29.87,28.05 IC3.4
N$5
  Top 0.61: C14.2 6.81,32.06 Q3.2 6.81,30.31 8.74,30.31 8.74,24.8 U$1.7
N$6  (1 unrouted)
  Top 0.61: C15.2 6.91,23.52 6.91,23.6 | 6.91,23.6 6.91,25.43 | U$1.8 6.91,23.52 6.91,23.6
N$7
  Top 0.813: JP2.4 38.71,9.75 Q5.3
N$8  (via drill 0.3)
  Top 0.406: Q5.1 40.22,13.83 v40.23,13.85 | v36.37,8.77 34.44,8.77 R6.1
  Bottom 0.406: v40.23,13.85 36.37,13.85 v36.37,8.77
N$9
  Top 0.61: U$1.4 9.75,28.61 9.75,33.36 5.86,33.36 C16.2
N$10
  Top 0.406: C22.+ 91.03,29.75 91.03,39.25 89.07,39.25 S1.28
N$11  (via drill 0.3)
  Top 0.406: v82.7,32.14 82.7,30.2 S1.18 | C23.1 72.95,24.82 v75.79,24.82
  Bottom 0.406: v82.7,32.14 82.7,28.48 77.64,28.48 J1.1 75.79,26.13 v75.79,24.82
N$12
  Top 0.813: REL1.COIL0 25.99,15.02 Q2.3 29.53,11.4 D2.A
N$13
  Top 0.813: Q2.1 31.85,13.95 R11.1
N$14
  Bottom 1.422: J2.1 11.4,15.63 REL1.SWCLOSED
N$15
  Bottom 1.422: J2.2 26.38,10.63 REL1.SWCOMMON
N$16  (1 unrouted)
  Bottom 1.422: J2.3 11.47,5.63 12.39,4.7
N$17
  Top 0.406: S1.17 81.57,27.57 85.55,23.6 85.55,22.43 R7.1
  Top 0.813: R7.1 88.06,22.43 C25.2
N$18  (via drill 0.3)
  Top 0.406: R7.2 81.99,24.21 v82.09,24.21
  Bottom 0.406: v82.09,24.21 84.12,24.21 84.12,27.67 80.18,27.67 J1.2
N$19
  Top 0.813: R14.1 R13.1 66.45,15.12 66.45,11.82 71.53,11.82 IC2.5
N$20  (via drill 0.3)  (1 unrouted)
  Top 0.406: R8.1 76.73,23.93 80.47,27.67 80.47,30.31
  Top 0.813: C24.2 v97.03,22.28 | v74.98,22.38 R8.1
  Bottom 0.813: v97.03,22.28 v74.98,22.38
N$21  (via drill 0.3)
  Top 0.406: R8.2 79.55,24.21 v80.26,24.21
  Bottom 0.406: v80.26,24.21 81.08,24.21 81.69,26.24 82.72,26.24 J1.3
N$22  (via drill 0.3)  (1 unrouted)
  Top 0.406: C26.2 71.12,25.46 v71.12,25.63 | v79.45,32.14 79.45,30.31 | R9.1 76.2,55.56 v76.2,55.5
  Bottom 0.406: v71.12,25.63 71.12,30.51 76.2,30.51 | 76.2,30.51 79.45,30.51 v79.45,32.14 | v76.2,55.5 76.2,30.51
N$23  (via drill 0.3)
  Top 0.406: R9.2 v82.7,53.67 | v82.7,53.67
  Bottom 0.406: v82.7,53.67 82.7,51.53 J1.7
N$24  (via drill 0.3)
  Top 0.406: S1.32 89,43.6 89,43.72 v91.03,43.72 | X1.3 88.24,56.52 91.03,56.52 91.03,46.56 v91.03,45.75
  Bottom 0.406: v91.03,43.72 v91.03,45.75
N$25
  Top 0.61: R21.2 96.93,41.53 Q6.1
  Top 0.813: R20.1 R21.2
N$26
  Top 0.813: Q6.3 94.08,38.86 R22.1
N$27
  Top 0.813: R22.2 97,36.1 D1.C
N$28  (via drill 0.3)
  Top 0.406: X2.3 73.3,56.32 70.31,56.32 v70.31,53.67 | v70.31,48.19 70.31,47.17 74.78,47.17 77.22,44.73 77.22,44.12 77.22,38.03 78.03,38.03 78.03,33.97 v84.94,33.97 | S1.20 84.94,30.27 v84.94,32.14
  Bottom 0.406: v70.31,53.67 v70.31,48.19 | v84.94,32.14 v84.94,33.97
N$29
  Top 0.406: R24.1 63.67,44.94 Q10.1
PWR4V2_ON  (via drill 0.3)
  Top 0.406: IC3.15 40.26,16.9 v40.23,16.9 | v71.53,20.15 IC2.1
  Top 0.813: IC2.1 71.58,18.52 71.68,18.62
  Bottom 0.406: v40.23,16.9 59.54,16.9 59.54,20.96 71.53,20.96 v71.53,20.15
RELAY  (via drill 0.3)
  Top 0.406: IC3.42 39.46,30.1 v38.61,30.1 | R11.2 31.85,6.79 v31.9,6.74
  Bottom 0.406: v38.61,30.1 38.2,30.1 35.56,33.76 33.33,33.76 33.33,27.87 29.46,24.01 29.46,6.74 31.7,6.74 | 31.7,6.74 v31.9,6.74 31.7,6.74
RESET  (via drill 0.3)
  Top 0.406: U$1.13 19.3,28.61 v19.3,28.48 | C12.1 23.16,35.54 v23.16,35.39
  Bottom 0.406: v23.16,35.39 23.16,28.48 v19.3,28.48 19.3,28.61
RX
  Top 0.406: U$1.2 16.05,31.14 16.05,20.55 29.46,20.55 29.46,24.01 36.06,24.01 IC3.9
SCK  (via drill 0.3)  (1 unrouted)
  Top 0.406: U$3.5 41.86,38.79 v41.86,37.22 | v30.68,37.22 30.68,28.89 36.17,28.89
  Bottom 0.406: v41.86,37.22 v30.68,37.22
SCL  (via drill 0.3)
  Top 0.406: IC3.19 43.48,20.62 v43.48,16.08
  Top 0.813: JP2.2 43.74,6.74 R3.1
  Bottom 0.406: v43.48,16.08 43.79,15.78 JP2.2
SDA  (via drill 0.3)  (1 unrouted)
  Top 0.406: IC3.20 44.26,16.53 v44.7,16.08 | v48.36,9.99 46.43,9.99
  Top 0.813: JP2.1 46.43,6.74 R2.1
  Bottom 0.406: v44.7,16.08 45.11,16.08 45.11,9.99 v48.36,9.99
TX
  Top 0.406: U$1.3 15.24,29.88 15.24,19.74 30.28,19.74 30.28,23.2 36.06,23.2 IC3.10

### Text on the board
tNames: BT | GSM | DOMOVOY BOILER 3.0.2 | KWLDesign